# Altium schematic sheet Injectors.SchDoc: Ravage - Injectors
size A4; Address1: Drawn By:; Address2: Dan Visser; DocumentNumber: A; Revision: 0.1-alpha; SheetNumber: 11; SheetTotal: 16
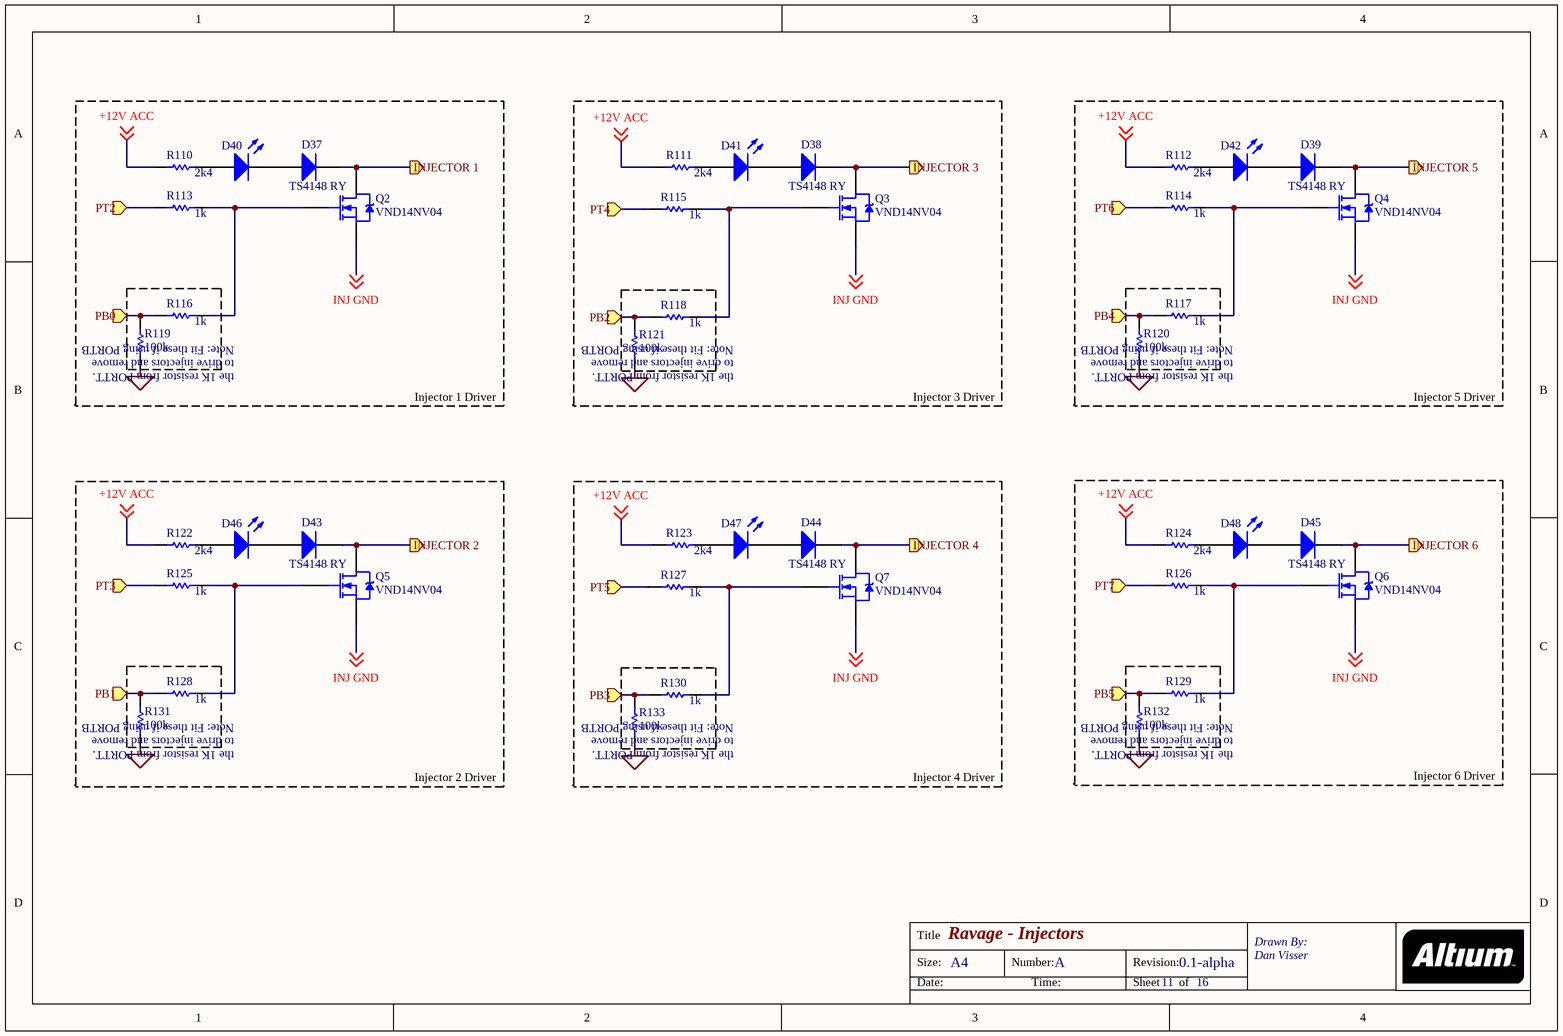
[diagram p0: Injectors.SchDoc]

## Parts
D37  TS4148 RY  [SMC]
D38  TS4148 RY  [SMC]
D39  TS4148 RY  [SMC]
D40  (no value)  [LED-0]
D41  (no value)  [LED-0]
D42  (no value)  [LED-0]
D43  TS4148 RY  [SMC]
D44  TS4148 RY  [SMC]
D45  TS4148 RY  [SMC]
D46  (no value)  [LED-0]
D47  (no value)  [LED-0]
D48  (no value)  [LED-0]
Q2  VND14NV04  [TO-220AB]
Q3  VND14NV04  [TO-220AB]
Q4  VND14NV04  [TO-220AB]
Q5  VND14NV04  [TO-220AB]
Q6  VND14NV04  [TO-220AB]
Q7  VND14NV04  [TO-220AB]
R110  value 2k4  [AXIAL-0.3]
R111  value 2k4  [AXIAL-0.3]
R112  value 2k4  [AXIAL-0.3]
R113  value 1k  [AXIAL-0.3]
R114  value 1k  [AXIAL-0.3]
R115  value 1k  [AXIAL-0.3]
R116  value 1k  [AXIAL-0.3]
R117  value 1k  [AXIAL-0.3]
R118  value 1k  [AXIAL-0.3]
R119  value 100k  [AXIAL-0.3]
R120  value 100k  [AXIAL-0.3]
R121  value 100k  [AXIAL-0.3]
R122  value 2k4  [AXIAL-0.3]
R123  value 2k4  [AXIAL-0.3]
R124  value 2k4  [AXIAL-0.3]
R125  value 1k  [AXIAL-0.3]
R126  value 1k  [AXIAL-0.3]
R127  value 1k  [AXIAL-0.3]
R128  value 1k  [AXIAL-0.3]
R129  value 1k  [AXIAL-0.3]
R130  value 1k  [AXIAL-0.3]
R131  value 100k  [AXIAL-0.3]
R132  value 100k  [AXIAL-0.3]
R133  value 100k  [AXIAL-0.3]

## Ports
INJECTOR 1 (out), INJECTOR 2 (out), INJECTOR 3 (out), INJECTOR 4 (out), INJECTOR 5 (out), INJECTOR 6 (out), PB0 (in), PB1 (in), PB2 (in), PB3 (in), PB4 (in), PB5 (in), PT2 (in), PT3 (in), PT4 (in), PT5 (in), PT6 (in), PT7 (in)

## Nets
NetR119_1: R119.1 R120.1 R121.1 R131.1 R132.1 R133.1
+12V ACC: R110.1 R111.1 R112.1 R122.1 R123.1 R124.1 ; off-sheet +12V ACC
INJ GND: Q2.3(S) Q3.3(S) Q4.3(S) Q5.3(S) Q6.3(S) Q7.3(S) ; off-sheet INJ GND
INJECTOR 1: D37.2(K) Q2.2(D) ; port INJECTOR 1
INJECTOR 2: D43.2(K) Q5.2(D) ; port INJECTOR 2
INJECTOR 3: D38.2(K) Q3.2(D) ; port INJECTOR 3
INJECTOR 4: D44.2(K) Q7.2(D) ; port INJECTOR 4
INJECTOR 5: D39.2(K) Q4.2(D) ; port INJECTOR 5
INJECTOR 6: D45.2(K) Q6.2(D) ; port INJECTOR 6
PB0: R116.1 R119.2 ; port PB0
PB1: R128.1 R131.2 ; port PB1
PB2: R118.1 R121.2 ; port PB2
PB3: R130.1 R133.2 ; port PB3
PB4: R117.1 R120.2 ; port PB4
PB5: R129.1 R132.2 ; port PB5
PT2: R113.1 ; port PT2
PT3: R125.1 ; port PT3
PT4: R115.1 ; port PT4
PT5: R127.1 ; port PT5
PT6: R114.1 ; port PT6
PT7: R126.1 ; port PT7
NetD37_1: D37.1(A) D40.2(K)
NetD38_1: D38.1(A) D41.2(K)
NetD39_1: D39.1(A) D42.2(K)
NetD40_1: D40.1(A) R110.2
NetD41_1: D41.1(A) R111.2
NetD42_1: D42.1(A) R112.2
NetD43_1: D43.1(A) D46.2(K)
NetD44_1: D44.1(A) D47.2(K)
NetD45_1: D45.1(A) D48.2(K)
NetD46_1: D46.1(A) R122.2
NetD47_1: D47.1(A) R123.2
NetD48_1: D48.1(A) R124.2
NetQ2_1: Q2.1(G) R113.2 R116.2
NetQ3_1: Q3.1(G) R115.2 R118.2
NetQ4_1: Q4.1(G) R114.2 R117.2
NetQ5_1: Q5.1(G) R125.2 R128.2
NetQ6_1: Q6.1(G) R126.2 R129.2
NetQ7_1: Q7.1(G) R127.2 R130.2

## Notes on the sheet
- (near R116) Note: Fit these if using PORTB
- to drive injectors and remove
- the 1K resistor from PORTT.
- (near R118) Note: Fit these if using PORTB
- (near R117) Note: Fit these if using PORTB
- Injector 1 Driver
- Injector 3 Driver
- Injector 5 Driver
- (near R128) Note: Fit these if using PORTB
- (near R130) Note: Fit these if using PORTB
- (near R129) Note: Fit these if using PORTB
- Injector 2 Driver
- Injector 4 Driver
- Injector 6 Driver
- Title
- Size:
- Date:
- A4
- Number:
- Time:
- Revision:
- Sheet
- of

## Library data of the parts
D37-D39 D43-D45 = Diode: Default Diode; Published: 8-Jun-2000; LatestRevisionDate: 17-Jul-2002; LatestRevisionNote: Re-released for DXP Platform.; PackageVersion: Sep-1996; PackageReference: SMC; Publisher: Altium Limited; PackageDescription: DO-214-AB/SMC; 2 C-Bend Leads; Body 7.9 x 5.9 mm, inc. leads (LxW); Code_JEDEC: DO-214-AB
D40-D42 D46-D48 = LED0: Typical INFRARED GaAs LED; Published: 8-Jun-2000; LatestRevisionDate: 08-Jul-2005; LatestRevisionNote: Mech Layer 1 removed.; PackageReference: LED-0; Publisher: Altium Limited; PackageDescription: LED; 2 Leads
Q2-Q7 = IRL520N: HEXFET Power MOSFET; Note: Pin 2 is electrically connected to pin 4 (Drain).; Published: 8-Jun-2000; LatestRevisionDate: 17-Jul-2002; LatestRevisionNote: Re-released for DXP Platform.; DatasheetVersion: May-1998; PackageVersion: Feb-1997; PackageReference: TO-220AB; Publisher: Altium Limited; PackageDescription: TO, Thru-Hole, Vertical, Heatsink Mounted; 3 In-Line Leads; Pitch 2.54 mm; ComponentLink1Description: Manufacturer Link; ComponentLink1URL: http://www.irf.com/; ComponentLink2Description: Datasheet; ComponentLink2URL: http://www.irf.com/product-info/datasheets/data/irl520n.pdf
R110-R133 = Res1: Resistor; Published: 8-Jun-2000; LatestRevisionDate: 17-Jul-2002; LatestRevisionNote: Re-released for DXP Platform.; PackageReference: AXIAL-0.3; Publisher: Altium Limited; PackageDescription: Axial Device, Thru-Hole; 2 Leads; 0.3 in Pin Spacing